# Altium schematic sheet BMS_SLAVE.SchDoc
size A4; SheetNumber: 1; SheetTotal: 7
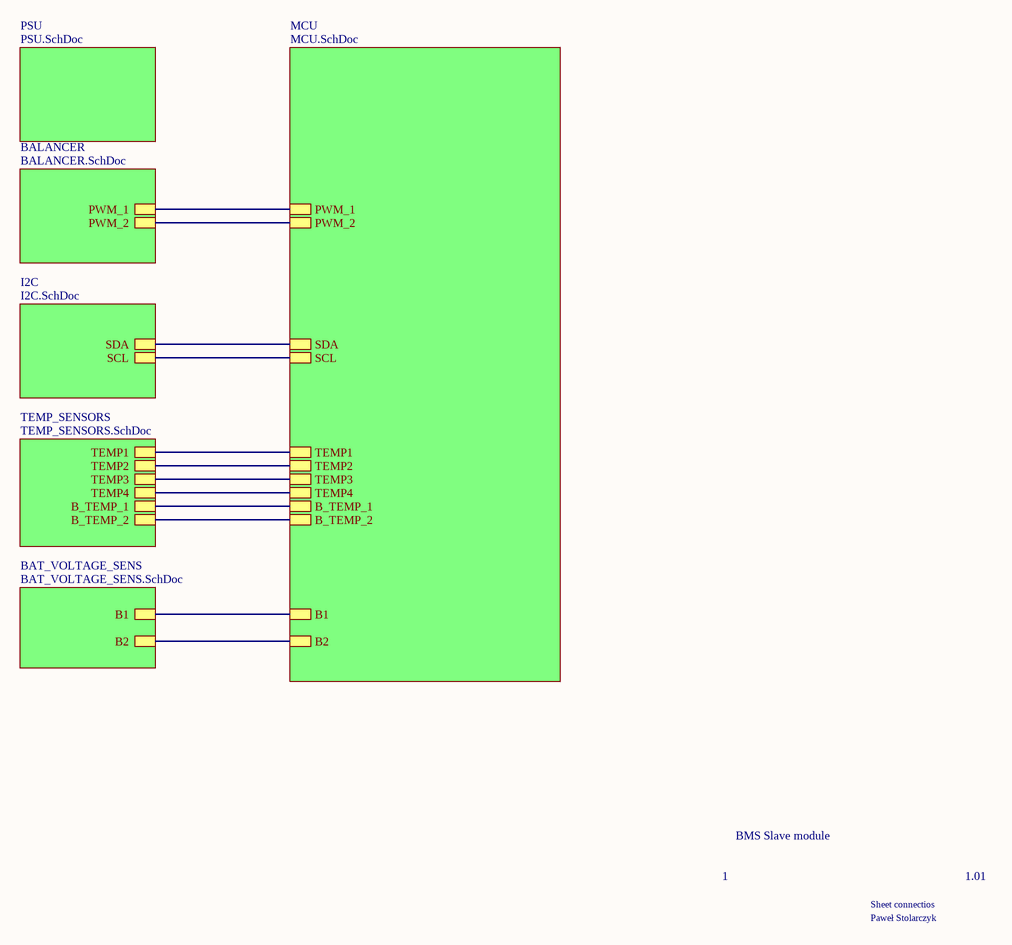
[diagram p0: BMS_SLAVE.SchDoc]

## Sub-sheets
BALANCER = BALANCER.SchDoc: PWM_1, PWM_2
BAT_VOLTAGE_SENS = BAT_VOLTAGE_SENS.SchDoc: B1, B2
I2C = I2C.SchDoc: SDA, SCL
MCU = MCU.SchDoc: TEMP1, TEMP2, TEMP3, TEMP4, B1, B2, SDA, SCL, PWM_1, PWM_2, B_TEMP_1, B_TEMP_2
PSU = PSU.SchDoc: no entries
TEMP_SENSORS = TEMP_SENSORS.SchDoc: TEMP1, TEMP2, TEMP3, TEMP4, B_TEMP_1, B_TEMP_2

## Nets
(unnamed): sheet MCU/TEMP1, sheet TEMP_SENSORS/TEMP1
(unnamed): sheet MCU/TEMP2, sheet TEMP_SENSORS/TEMP2
(unnamed): sheet MCU/TEMP3, sheet TEMP_SENSORS/TEMP3
(unnamed): sheet MCU/TEMP4, sheet TEMP_SENSORS/TEMP4
(unnamed): sheet MCU/B1, sheet BAT_VOLTAGE_SENS/B1
(unnamed): sheet MCU/B2, sheet BAT_VOLTAGE_SENS/B2
(unnamed): sheet MCU/SDA, sheet I2C/SDA
(unnamed): sheet MCU/SCL, sheet I2C/SCL
(unnamed): sheet MCU/PWM_1, sheet BALANCER/PWM_1
(unnamed): sheet MCU/PWM_2, sheet BALANCER/PWM_2
(unnamed): sheet MCU/B_TEMP_1, sheet TEMP_SENSORS/B_TEMP_1
(unnamed): sheet MCU/B_TEMP_2, sheet TEMP_SENSORS/B_TEMP_2

## Notes on the sheet
- BMS Slave module
- 1
- Sheet connectios
- 1.01
- Paweł Stolarczyk